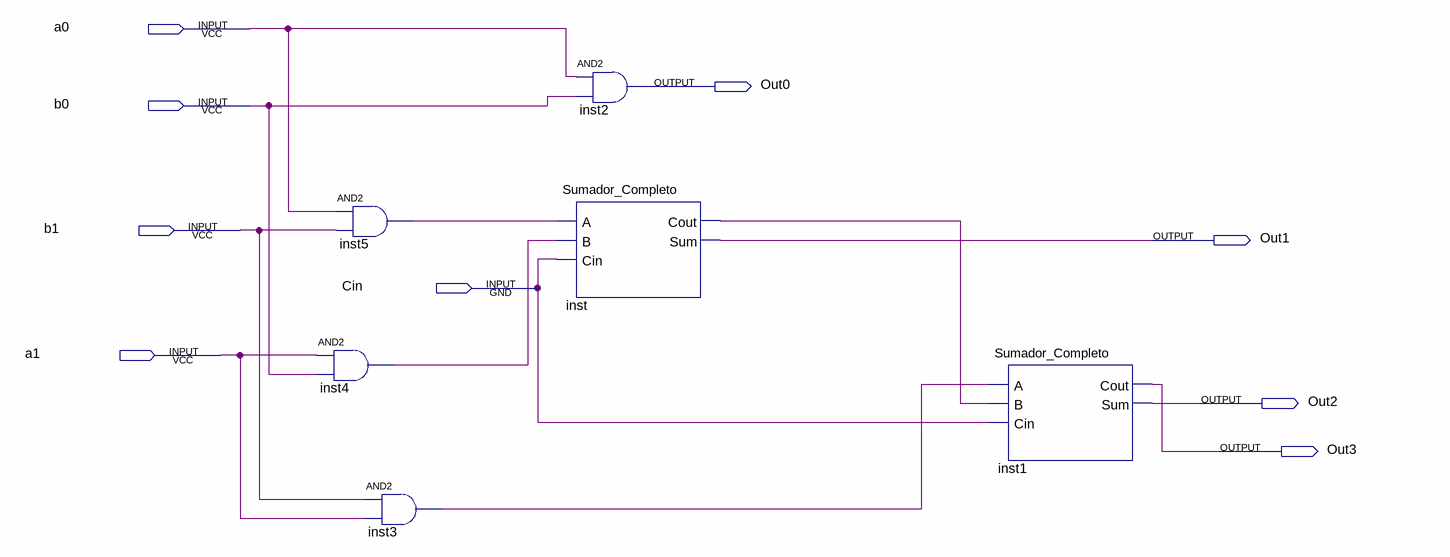
[diagram p0: schematic sheet]
// Quartus schematic multi2sinsigno.bdf as structural Verilog: 6 symbols, 9 pins
module multi2sinsigno (
  input  a0,
  input  b0,
  input  b1,
  input  Cin,
  input  a1,
  output Out0,
  output Out1,
  output Out2,
  output Out3
);

  wire inst3_out, inst4_out, inst5_out, inst_cout;

  and inst4 (inst4_out, a1, b0);
  and inst5 (inst5_out, a0, b1);
  and inst3 (inst3_out, b1, a1);
  and inst2 (Out0, a0, b0);
  Sumador_Completo inst (.A(inst5_out), .B(inst4_out), .Cin(Cin), .Cout(inst_cout), .Sum(Out1));
  Sumador_Completo inst1 (.A(inst3_out), .B(inst_cout), .Cin(Cin), .Cout(Out3), .Sum(Out2));
endmodule
